# EAGLE schematic PCB_v1 (EAGLE 8.6.2)
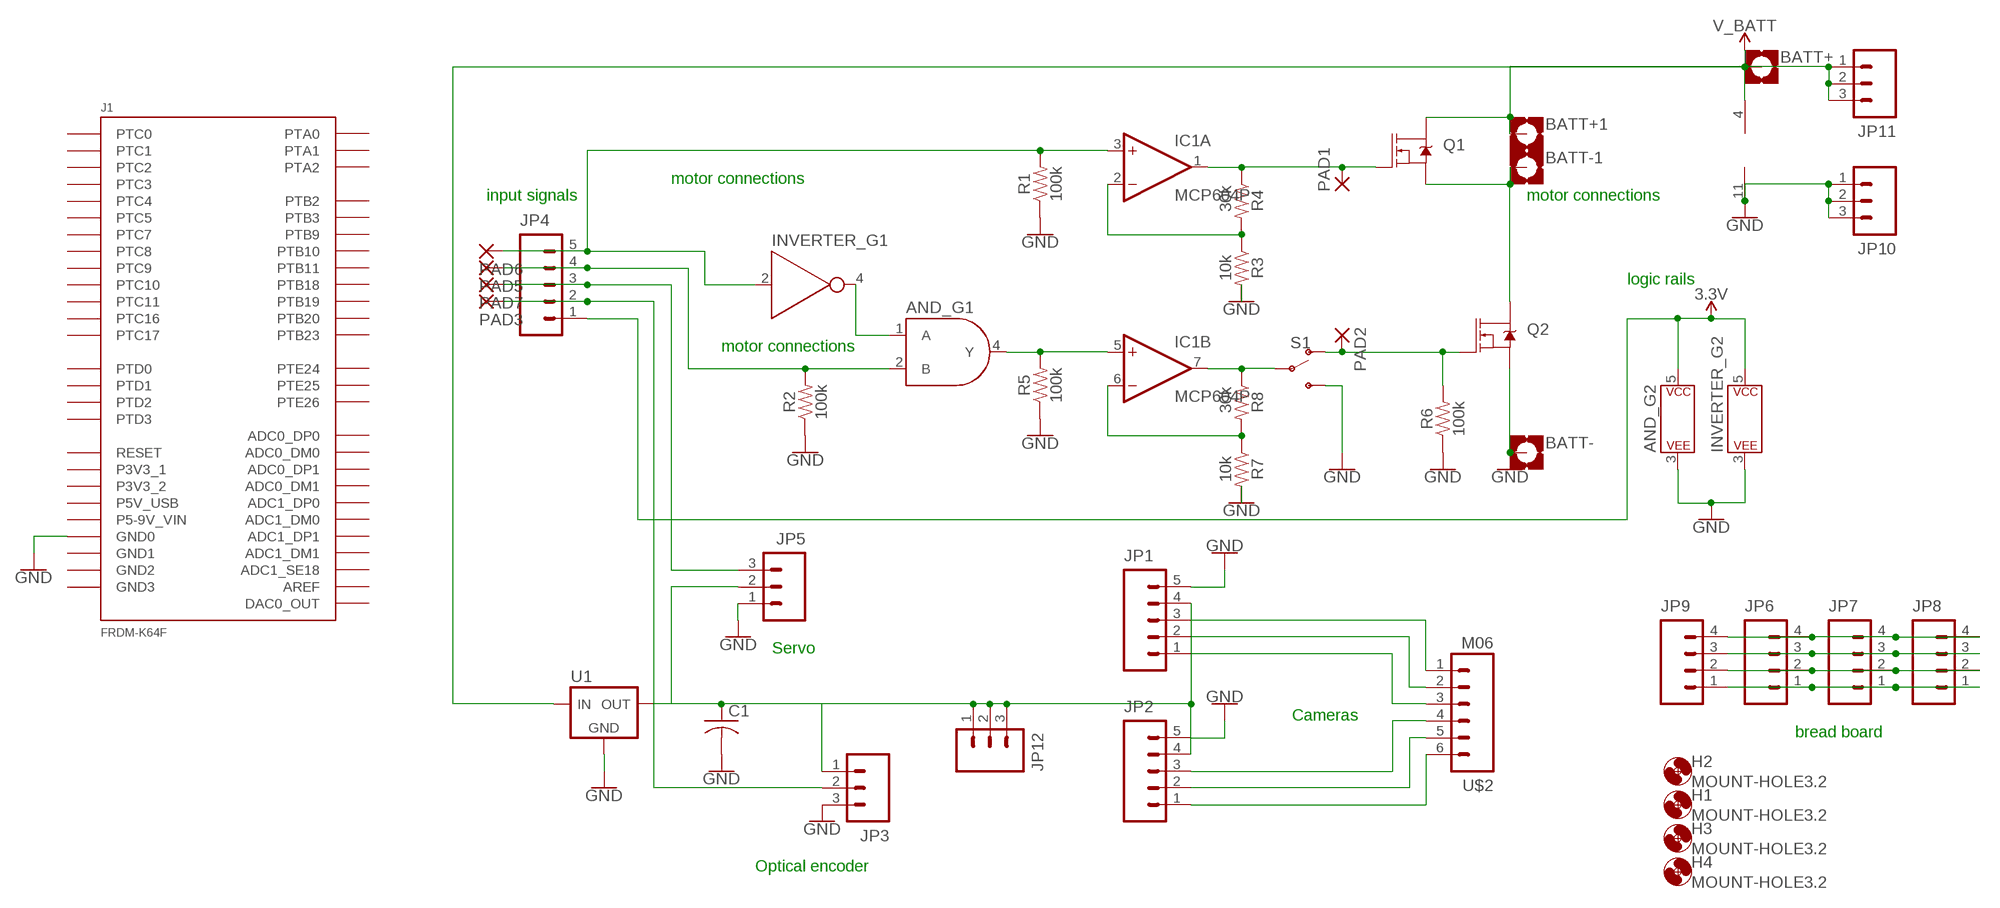
[diagram p0: schematic, sheet 1]

## Parts
AND_  74LVC08SE  [SOT23-5]
BATT+  MOUNT-PAD-SQUARE3.0  [3,0-PAD-SQUARE]
BATT+1  MOUNT-PAD-SQUARE3.0  [3,0-PAD-SQUARE]
BATT-  MOUNT-PAD-SQUARE3.0  [3,0-PAD-SQUARE]
BATT-1  MOUNT-PAD-SQUARE3.0  [3,0-PAD-SQUARE]
C1  C-075PTH  [C075]
H1  MOUNT-HOLE3.2  [3,2]
H2  MOUNT-HOLE3.2  [3,2]
H3  MOUNT-HOLE3.2  [3,2]
H4  MOUNT-HOLE3.2  [3,2]
IC1  MCP604P  [DIL14]
INVERTER_  74HC1G04  [SOT353]
J1  FRDM-K64F  [FRDM-K64F]
JP1  M05PTH  [1X05]
JP2  M05PTH  [1X05]
JP3  M03PTH  [1X03]
JP4  M05PTH  [1X05]
JP5  M03PTH  [1X03]
JP6  M04PTH  [1X04]
JP7  M04PTH  [1X04]
JP8  M04PTH  [1X04]
JP9  M04PTH  [1X04]
JP10  M03PTH  [1X03]
JP11  M03PTH  [1X03]
JP12  M03PTH  [1X03]
PAD1  2,15/1,0  [2,15/1,0]
PAD2  2,15/1,0  [2,15/1,0]
PAD3  2,15/1,0  [2,15/1,0]
PAD5  2,15/1,0  [2,15/1,0]
PAD6  2,15/1,0  [2,15/1,0]
PAD7  2,15/1,0  [2,15/1,0]
Q1  MOSFET-NCH-FQP30N06L  [TO220V]
Q2  MOSFET-NCH-FQP30N06L  [TO220V]
R1  100k  10KOHM-HORIZ-1/4W-1%  [AXIAL-0.3]
R2  100k  10KOHM-HORIZ-1/4W-1%  [AXIAL-0.3]
R3  10k  10KOHM-HORIZ-1/4W-1%  [AXIAL-0.3]
R4  30k  RESISTORAXIAL-0.3  [AXIAL-0.3]
R5  100k  10KOHM-HORIZ-1/4W-1%  [AXIAL-0.3]
R6  100k  10KOHM-HORIZ-1/4W-1%  [AXIAL-0.3]
R7  10k  10KOHM-HORIZ-1/4W-1%  [AXIAL-0.3]
R8  30k  RESISTORAXIAL-0.3  [AXIAL-0.3]
S1  SWITCH-SPDT-PTH-11.6X4.0MM-KIT  [SWITCH_SPDT_PTH_11.6X4.0MM_KIT]
U1  78XX-TO220V  [TO220BV]
U$2  M06  [1X06-MTA]

## Nets
3.3V: AND_.5(P$V+) INVERTER_.5(P$V+) JP4.1
GND: AND_.3(P$V-) BATT-.B3,0(MOUNT) C1.2(-) IC1.11(P:V-) INVERTER_.3(P$V-) J1.J2-3(GND0) JP1.5 JP2.5 JP3.3 JP5.1 JP10.1 JP10.2 JP10.3 Q2.3(S) R1.P$1 R2.P$1 R3.P$2 R5.P$1 R6.P$1 R7.P$2 S1.3(S) U1.2(GND)
N$1: IC1.2(A:-IN) R3.P$1 R4.P$2
N$2: IC1.1(A:OUT) PAD1.1(P) Q1.1(G) R4.P$1
N$3: IC1.6(B:-IN) R7.P$1 R8.P$2
N$4: AND_.4(Y) IC1.5(B:+IN) R5.P$2
N$5: PAD2.1(P) Q2.1(G) R6.P$2 S1.1(O)
N$6: BATT-1.B3,0(MOUNT) Q1.3(S) Q2.2(D)
N$7: IC1.7(B:OUT) R8.P$1 S1.2(P)
N$8: AND_.1(A) INVERTER_.4(Y)
N$9: JP2.1 U$2.6
N$10: JP2.2 U$2.5
N$11: JP2.3 U$2.4
N$12: JP1.1 U$2.3
N$13: JP1.2 U$2.2
N$14: JP1.3 U$2.1
N$15: JP4.3 JP5.3 PAD7.1(P)
N$16: IC1.3(A:+IN) INVERTER_.2(A) JP4.5 PAD6.1(P) R1.P$2
N$17: AND_.2(B) JP4.4 PAD5.1(P) R2.P$2
N$18: C1.1(+) JP1.4 JP2.4 JP3.1 JP12.1 JP12.2 JP12.3 U1.3(VOUT)
N$19: JP3.2 JP4.2 PAD3.1(P)
N$20: JP5.2
N$22: JP6.4 JP7.4 JP8.4 JP9.4
N$23: JP6.3 JP7.3 JP8.3 JP9.3
N$24: JP6.2 JP7.2 JP8.2 JP9.2
N$25: JP6.1 JP7.1 JP8.1 JP9.1
V_BATT: BATT+1.B3,0(MOUNT) BATT+.B3,0(MOUNT) IC1.4(P:V+) JP11.1 JP11.2 JP11.3 Q1.2(D) U1.1(VIN)
Unconnected: IC1.8(C:OUT) IC1.9(C:-IN) IC1.10(C:+IN) IC1.12(D:+IN) IC1.13(D:-IN) IC1.14(D:OUT) J1.J1-1(PTB18) J1.J1-2(PTC16) J1.J1-3(PTB19) J1.J1-4(PTC17) J1.J1-5(PTC1) J1.J1-6(PTB9) J1.J1-7(PTC8) J1.J1-8(PTA1) J1.J1-9(PTC9) J1.J1-10(PTB23) J1.J1-11(PTC0) J1.J1-12(PTA2) J1.J1-13(PTC7) J1.J1-14(PTC2) J1.J1-15(PTC5) J1.J1-16(PTC3) J1.J2-1(PTE26) J1.J2-2(PTA0) J1.J2-4(PTC4) J1.J2-5(ADC0_DP0) J1.J2-6(PTD0) J1.J2-7(ADC0_DM0) J1.J2-8(PTD2) J1.J2-10(PTD3) J1.J2-11(ADC1_DP0) J1.J2-12(PTD1) J1.J2-13(ADC1_DM0) J1.J2-14(GND1) J1.J2-16(AREF) J1.J2-17(ADC1_SE18) J1.J2-18(PTE25) J1.J2-20(PTE24) J1.J3-4(P3V3_1) J1.J3-6(RESET) J1.J3-8(P3V3_2) J1.J3-10(P5V_USB) J1.J3-12(GND2) J1.J3-14(GND3) J1.J3-16(P5-9V_VIN) J1.J4-1(ADC0_DP1) J1.J4-2(PTB2) J1.J4-3(ADC0_DM1) J1.J4-4(PTB3) J1.J4-5(ADC1_DP1) J1.J4-6(PTB10) J1.J4-7(ADC1_DM1) J1.J4-8(PTB11) J1.J4-9(PTB20) J1.J4-10(PTC11) J1.J4-11(DAC0_OUT) J1.J4-12(PTC10)

## Notes on the sheet
- motor connections
- input signals | motor connections
- logic rails
- motor connections
- Servo
- Cameras
- bread board
- Optical encoder

## Library data of the parts
AND_ = SparkFun-IC-Logic:74*08: Single AND gate IC GATE AND SNGL 2INPUT SOT353 SparkFun Products SparkFun LogicBlocks Kit <https://www.sparkfun.com/products/11006> (KIT-11006) SparkFun RedBot Mainboard <https://www.sparkfun.com/products/12097> (ROB-12097); PROD_ID: IC-10841; VALUE: 74LVC1G08SE
BATT+ BATT+1 BATT- BATT-1 = holes:MOUNT-PAD-SQUARE: MOUNTING PAD, square
C1 = bt_rcl:C: Capacitor, non-polarized, American symbol
H1-H4 = holes:MOUNT-HOLE: MOUNTING HOLE with drill center marker
IC1 = linear:MCP604: Quad Op Amp 2.7V to 6.0V Single Supply CMOS Source: http://ww1.microchip.com/downloads/en/DeviceDoc/21314g.pdf
INVERTER_ = SparkFun-IC-Logic:74*1G04: Single Inverter IC NOT GATE INVERTER SNGL 1IN SOT353 Supply: 1.65V to 5.5V Datasheet <http://diodes.com/datasheets/74LVC1G04.pdf> SparkFun Products SparkFun Stepoko <https://www.sparkfun.com/products/13899> (ROB-13899) SparkFun CryptoShield <https://www.sparkfun.com/products/13183> (DEV-13183) SparkFun LogicBlocks Kit <https://www.sparkfun.com/products/11006> (KIT-11006) SparkFun ArduMoto <https://www.sparkfun.com/products/9815> (DEV-09815); PROD_ID: COMP-08268; VALUE: 74HC1G04
J1 = ee192:FRDM-K64F: Shield for Freescale Freedom board FRDM-K64F by nathan wong, Team 7 Sp 2016
JP1 JP2 JP4 = ee192:M05: 5-pin 0.1-inch header and MTA connector Courtsey of Pioneers in Engineering; PIE-INT-REF-NUM: BULK-STOCK
JP3 JP5 JP10-JP12 = ee192:M03: 3-pin 0.1-inch header and MTA connector Courtsey of Pioneers in Engineering; PIE-INT-REF-NUM: BULK-STOCK
JP6-JP9 = ee192:M04: 4-pin 0.1-inch header and MTA connector Courtsey of Pioneers in Engineering; PIE-INT-REF-NUM: BULK-STOCK
PAD1-PAD3 PAD5-PAD7 = wirepad:2,15/1,0: THROUGH-HOLE PAD
Q1 Q2 = SparkFun-DiscreteSemi:MOSFET-NCH: N-channel MOSFETs Voltage controlled devices that allow control of high current outputs. SparkFun Products: SparkFun OpenScale <https://www.sparkfun.com/products/13261> SparkFun Digital Sandbox <https://www.sparkfun.com/products/12651> SparkFun Monster Moto Shield <https://www.sparkfun.com/products/10182> SparkFun MOSFET Power Controller <https://www.sparkfun.com/products/11214>; PROD_ID: TRANS-10060; VALUE: 60V/32A/35mΩ
R1 R2 R5 R6 = SparkFun-Resistors:10KOHM: 10kΩ resistor A resistor is a passive two-terminal electrical component that implements electrical resistance as a circuit element. Resistors act to reduce current flow, and, at the same time, act to lower voltage levels within circuits. - Wikipedia; PROD_ID: RES-12183; VALUE: 10k
R3 R7 = SparkFun-Resistors:10KOHM: 10kΩ resistor A resistor is a passive two-terminal electrical component that implements electrical resistance as a circuit element. Resistors act to reduce current flow, and, at the same time, act to lower voltage levels within circuits. - Wikipedia; PROD_ID: RES-12183
R4 R8 = SparkFun-Resistors:RESISTOR: Generic Resistor Package
S1 = SparkFun-Switches:SWITCH-SPDT: Single Pole, Double Throw (SPDT) Switch Single-pole, double-throw (SPDT) switch. Variant Overview SMD-AYZ0202 Surface Mount DPDT Switch <https://www.sparkfun.com/products/597> (COM-00597) Used on e.g. LilyPad Arduino USB - ATmega32U4 Board <https://www.sparkfun.com/products/12049> PTH-11.6X4.0MM SPDT Mini Power Switch <https://www.sparkfun.com/products/102> (COM-00102) Used on e.g. SparkFun Simon Says - Through-Hole Soldering Kit <https://www.sparkfun.com/products/10547> (KIT-10547) PTH-11.6X4.0MM-KIT KIT version of SPDT Mini Power Switch - Simplifies soldering by removing tStop of switch pins - only one side can be soldered. PTH-11.6X4.0MM-LOCK LOCK version of SPDT Mini Power Switch - Offset pins hold switch in place for easier soldering. SMD-RIGHT-ANGLE Surface Mount Right Angle Switch <https://www.sparkfun.com/products/10860> (COM-10860) Used on e.g. SparkFun ESP8266 Thing <https://www.sparkfun.com/products/13231>; PROD_ID: SWCH-08261; SF_SKU: COM-00102
U1 = bt_regulator:78XX: 78XX Linear Voltage Regulator The venerable 7800-series Linear Voltage Regulator, including 7805, 7809, 7812, 7815, 7862 in 5 V, 6.2 V, 8.2 V, 9 V, 12 V, and 15 V, respectively Datasheets TI_LM78L05.pdf <http://www.ti.com/lit/ds/symlink/lm78l05.pdf> Fairchild_LM7805.pdf <https://www.fairchildsemi.com/datasheets/LM/LM7805.pdf>
U$2 = ee192:M06: 6-pin 0.1-inch MTA connector Courtsey of Pioneers in Engineering; PIE-INT-REF-NUM: MTA